# Altium schematic sheet 03 ETHERNET 1 Gbps.SchDoc
size A2; SheetNumber: 4; SheetTotal: 16
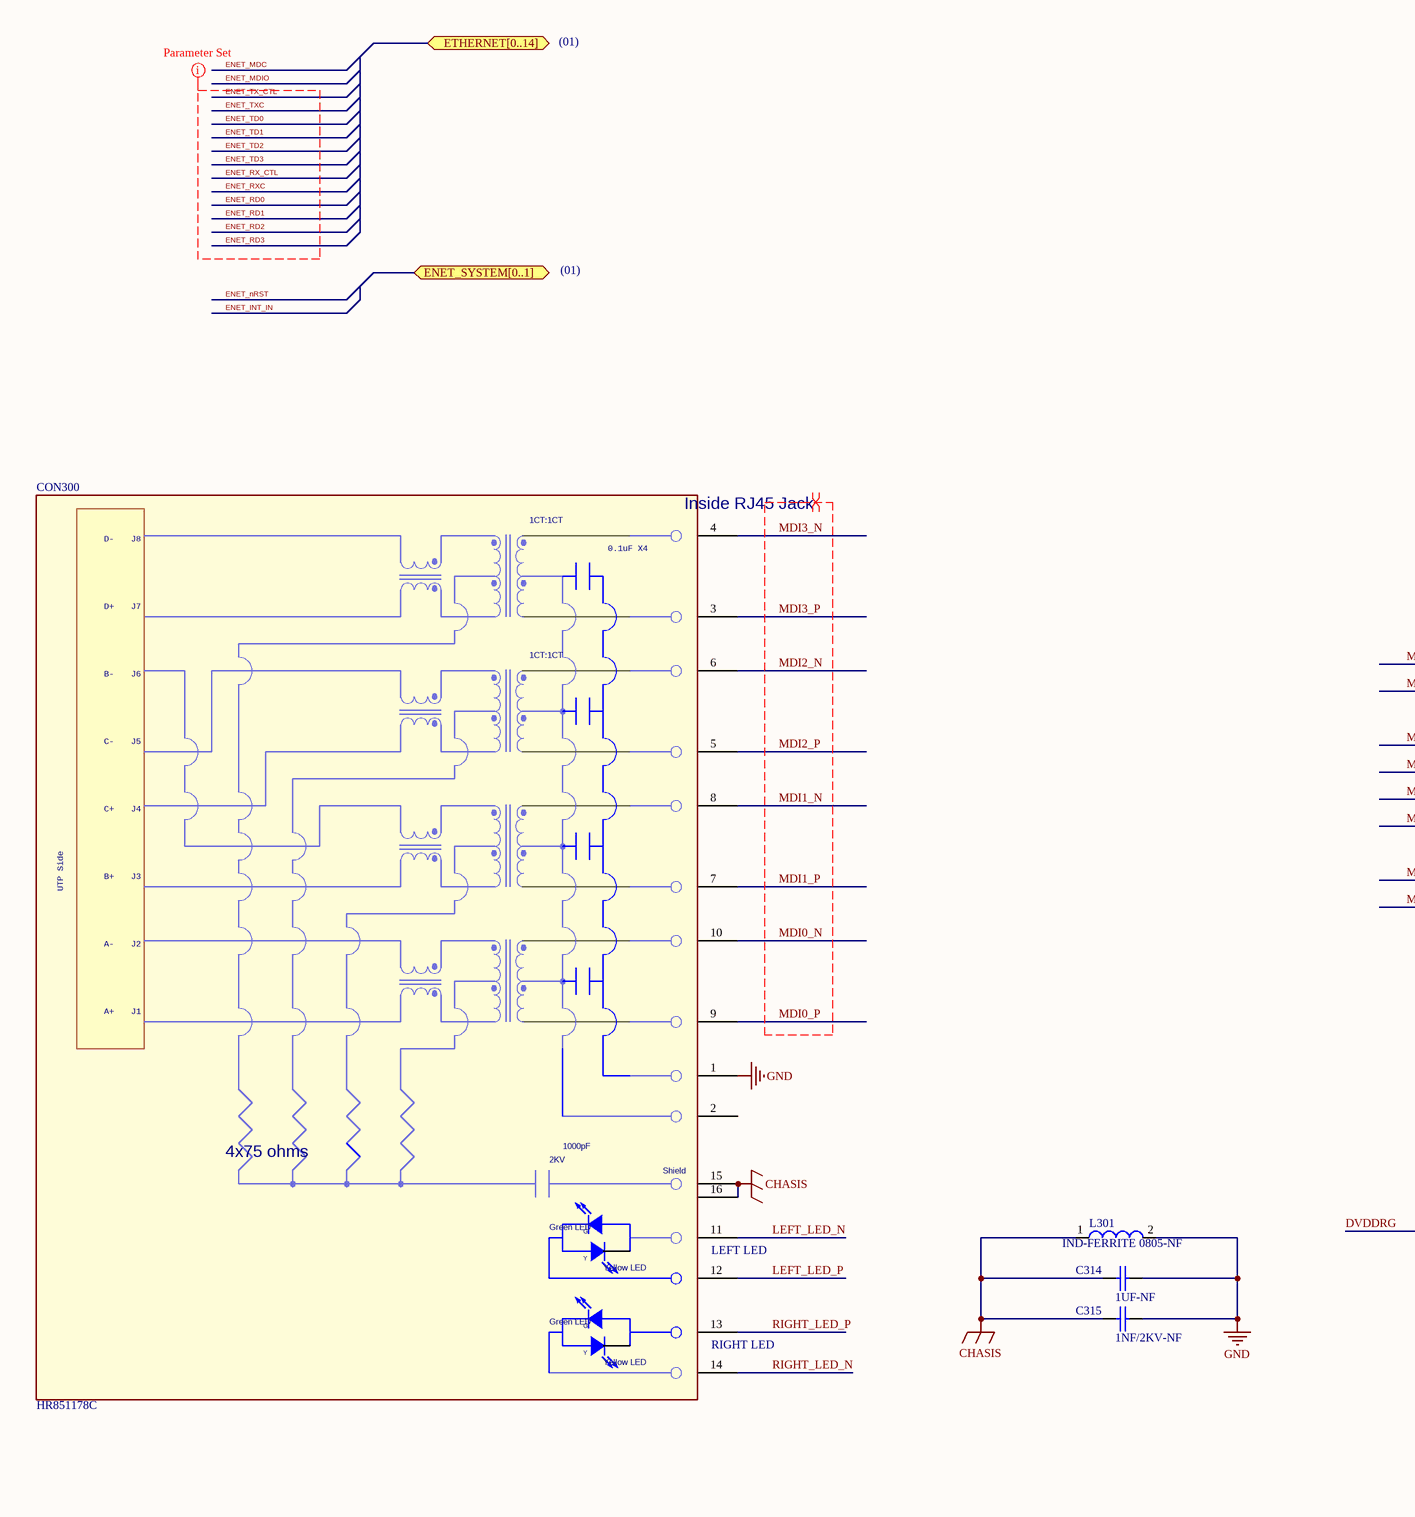
[diagram p0: 03 ETHERNET 1 Gbps.SchDoc, left]
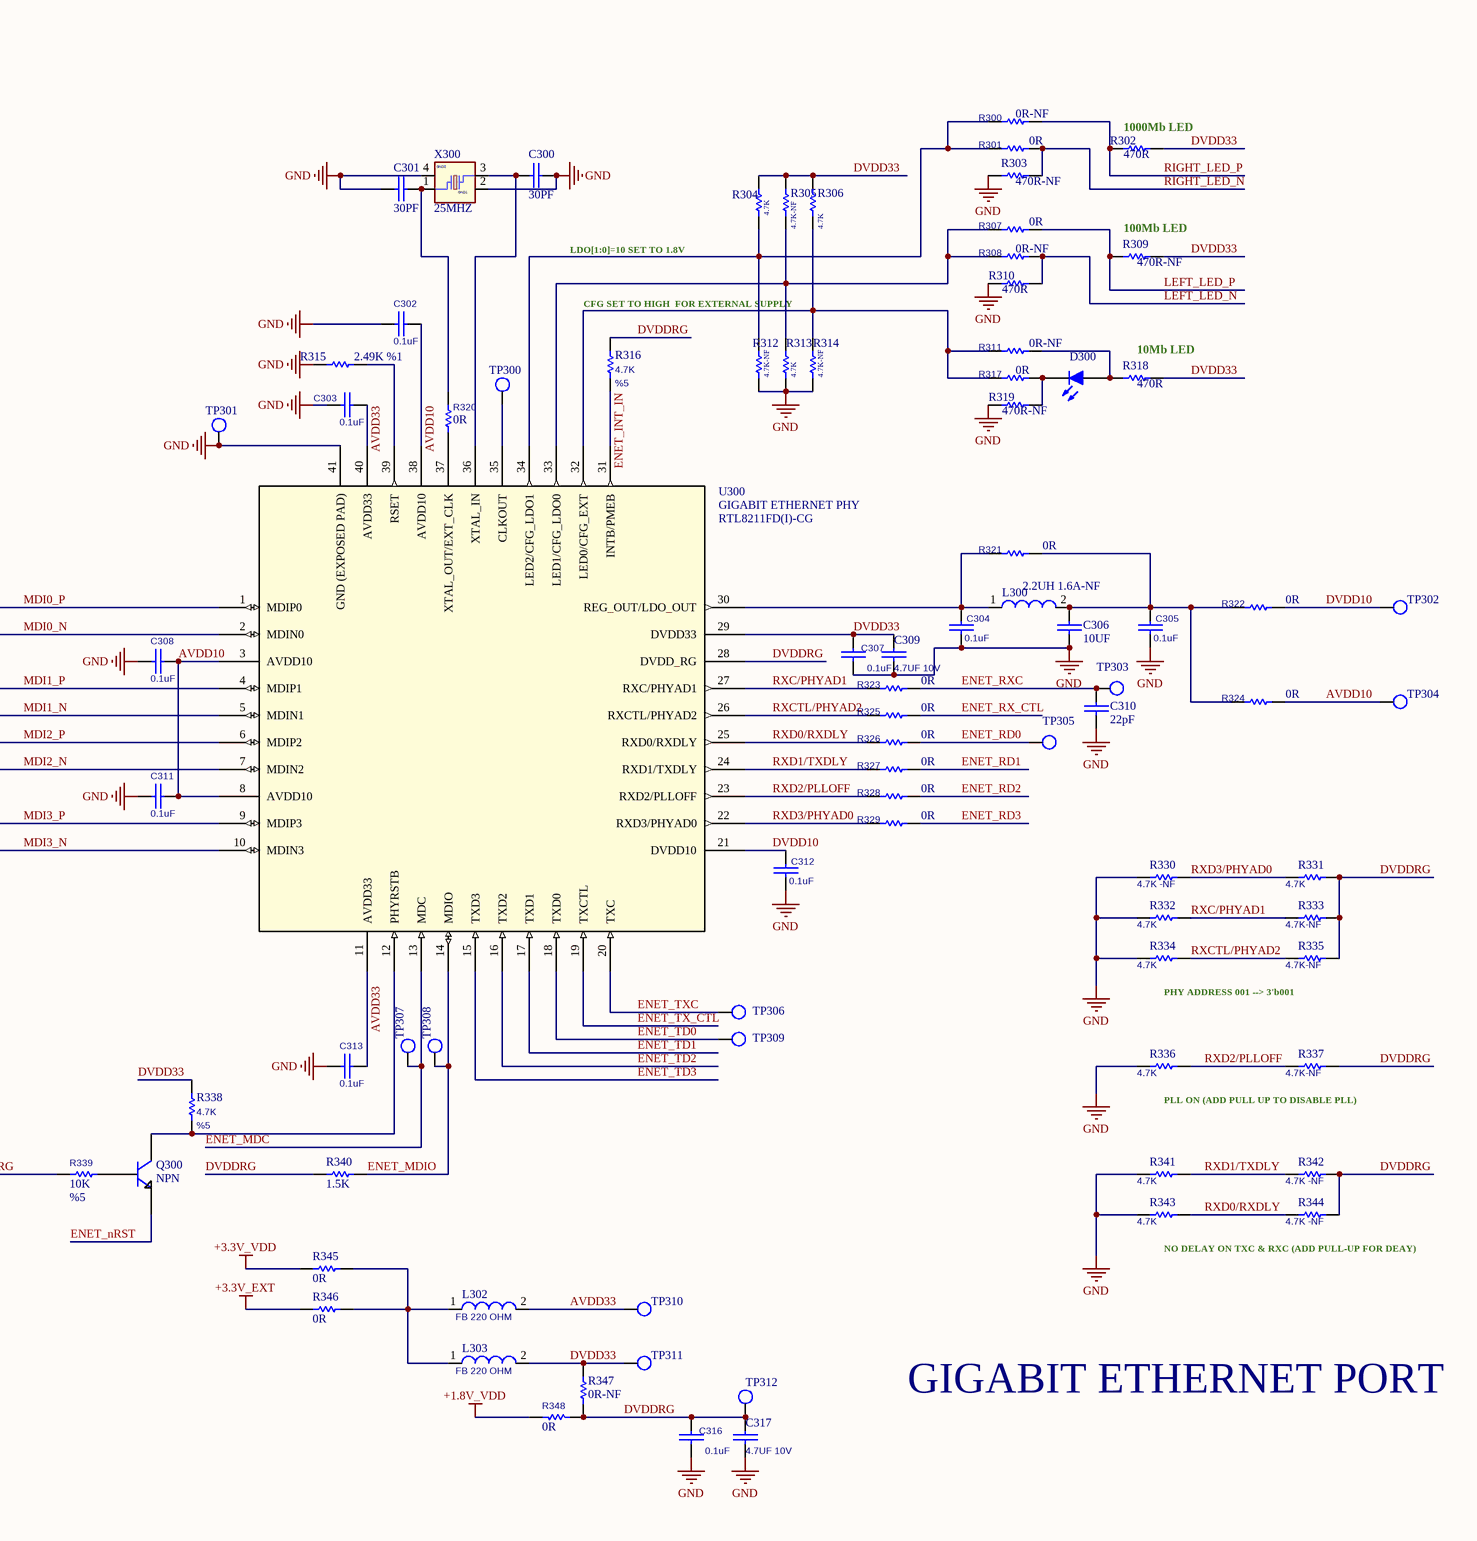
[diagram p1: 03 ETHERNET 1 Gbps.SchDoc, right]

## Parts
C300  30PF  [0402_CC]
C301  30PF  [0402_CC]
C302  0.1uF  [0402_CC]
C303  0.1uF  [0402_CC]
C304  0.1uF  [0402_CC]
C305  0.1uF  [0402_CC]  (no BOM)
C306  10UF  [0805]
C307  0.1uF  [0402_CC]
C308  0.1uF  [0402_CC]
C309  4.7UF 10V  [0402_CC]
C310  22pF  [0402_CC]  (no BOM)
C311  0.1uF  [0402_CC]
C312  0.1uF  [0402_CC]
C313  0.1uF  [0402_CC]
C314  1UF-NF  [0805]  (no BOM)
C315  1NF/2KV-NF  [1206]  (no BOM)
C316  0.1uF  [0402_CC]
C317  4.7UF 10V  [0402_CC]
CON300  HR851178C  [HR851178C]
D300  GREEN  [0603_LED]  (value not drawn)
L300  2.2UH 1.6A-NF  [2016]  (no BOM)
L301  IND-FERRITE 0805-NF  [0805]
L302  FB 220 OHM  [0603_RES]
L303  FB 220 OHM  [0603_RES]
Q300  NPN  [SOT23]
R300  0R-NF  [0402_RES]  (no BOM)
R301  0R  [0402_RES]
R302  470R  [0402_RES]
R303  470R-NF  [0402_RES]  (no BOM)
R304  4.7K  [0402_RES]
R305  4.7K-NF  [0402_RES]  (no BOM)
R306  4.7K  [0402_RES]
R307  0R  [0402_RES]
R308  0R-NF  [0402_RES]  (no BOM)
R309  470R-NF  [0402_RES]  (no BOM)
R310  470R  [0402_RES]
R311  0R-NF  [0402_RES]  (no BOM)
R312  4.7K-NF  [0402_RES]  (no BOM)
R313  4.7K  [0402_RES]
R314  4.7K-NF  [0402_RES]  (no BOM)
R315  2.49K %1  [0603_RES]
R316  4.7K  Tolerance: %5  [0402_RES]
R317  0R  [0402_RES]
R318  470R  [0402_RES]
R319  470R-NF  [0402_RES]  (no BOM)
R320  0R  [0402_RES]
R321  0R  [0402_RES]
R322  0R  [0402_RES]
R323  0R  [0402_RES]
R324  0R  [0402_RES]
R325  0R  [0402_RES]
R326  0R  [0402_RES]
R327  0R  [0402_RES]
R328  0R  [0402_RES]
R329  0R  [0402_RES]
R330  4.7K -NF  [0402_RES]  (no BOM)
R331  4.7K  [0402_RES]
R332  4.7K  [0402_RES]
R333  4.7K-NF  [0402_RES]  (no BOM)
R334  4.7K  [0402_RES]
R335  4.7K-NF  [0402_RES]  (no BOM)
R336  4.7K  [0402_RES]
R337  4.7K-NF  [0402_RES]  (no BOM)
R338  4.7K  Tolerance: %5  [0402_RES]
R339  10K  Tolerance: %5  [0402_RES]
R340  1.5K  [0402_RES]
R341  4.7K  [0402_RES]
R342  4.7K -NF  [0402_RES]  (no BOM)
R343  4.7K  [0402_RES]
R344  4.7K -NF  [0402_RES]  (no BOM)
R345  0R  [0603_RES]
R346  0R  [0603_RES]
R347  0R-NF  [0603_RES]  (no BOM)
R348  0R  [0402_RES]
TP300  TEST POINT 35  [testpoint_15]  (value not drawn)  (no BOM)
TP301  TEST POINT 35  [testpoint_15]  (value not drawn)  (no BOM)
TP302  TEST POINT 35  [testpoint_15]  (value not drawn)  (no BOM)
TP303  TEST POINT 35  [testpoint_15]  (value not drawn)  (no BOM)
TP304  TEST POINT 35  [testpoint_15]  (value not drawn)  (no BOM)
TP305  TEST POINT 35  [testpoint_15]  (value not drawn)  (no BOM)
TP306  TEST POINT 35  [testpoint_15]  (value not drawn)  (no BOM)
TP307  TEST POINT 35  [testpoint_15]  (value not drawn)  (no BOM)
TP308  TEST POINT 35  [testpoint_15]  (value not drawn)  (no BOM)
TP309  TEST POINT 35  [testpoint_15]  (value not drawn)  (no BOM)
TP310  TEST POINT 35  [testpoint_15]  (value not drawn)  (no BOM)
TP311  TEST POINT 35  [testpoint_15]  (value not drawn)  (no BOM)
TP312  TEST POINT 35  [testpoint_15]  (value not drawn)  (no BOM)
U300  GIGABIT ETHERNET PHY  Manufacturer Part Number-1: RTL8211FD(I)-CG  [Quad40]
X300  25MHZ  [XTLOSC4_3P2X2P5MM_SM]

## Ports
ENET_SYSTEM[0..1] (bidir), ETHERNET[0..14] (bidir)

## Nets
+1.8V_VDD: R348.1
+3.3V_EXT: R346.1
+3.3V_VDD: R345.1
CHASIS: C314.1 C315.1 CON300.15(SH1) CON300.16(SH2) L301.1
GND: C300.2 C301.1 C302.1 C303.1 C304.2 C305.2 C306.2 C307.2 C308.1 C309.2 C310.2 C311.1 C312.2 C313.1 C314.2 C315.2 C316.2 C317.2 CON300.1 L301.2 R303.1 R310.1 R312.2 R313.2 R314.2 R315.1 R319.1 R330.2 R332.2 R334.2 R336.2 R341.2 R343.2 TP301.1 U300.41(GND_(EXPOSED_PAD)) X300.2(GND1) X300.4(GND2)
AVDD10: C302.2 C308.2 C311.2 R324.1 TP304.1 U300.3(AVDD10) U300.8(AVDD10) U300.38(AVDD10)
AVDD33: C303.2 C313.2 L302.2 TP310.1 U300.11(AVDD33) U300.40(AVDD33)
DVDD10: C312.1 R322.1 TP302.1 U300.21(DVDD10)
DVDD33: C307.1 C309.1 L303.2 R302.2 R304.1 R305.1 R306.1 R309.2 R318.2 R338.2 R347.2 TP311.1 U300.29(DVDD33)
DVDDRG: C316.1 C317.1 R316.2 R331.1 R333.1 R335.1 R337.1 R339.2 R340.1 R342.1 R344.1 R347.1 R348.2 TP312.1 U300.28(DVDD_RG)
ENET_INT_IN: R316.1 U300.31(INTB/PMEB)
ENET_MDC: TP307.1 U300.13(MDC)
ENET_MDIO: R340.2 TP308.1 U300.14(MDIO)
ENET_nRST: Q300.2(E)
ENET_RD0: R326.1 TP305.1
ENET_RD1: R327.1
ENET_RD2: R328.1
ENET_RD3: R329.1
ENET_RX_CTL: R325.1
ENET_RXC: C310.1 R323.1 TP303.1
ENET_TD0: TP309.1 U300.18(TXD0)
ENET_TD1: U300.17(TXD1)
ENET_TD2: U300.16(TXD2)
ENET_TD3: U300.15(TXD3)
ENET_TX_CTL: U300.19(TXCTL)
ENET_TXC: TP306.1 U300.20(TXC)
LEFT_LED_N: CON300.11 R308.1 R310.2
LEFT_LED_P: CON300.12 R307.1 R309.1
MDI0_N: CON300.10 U300.2(MDIN0)
MDI0_P: CON300.9 U300.1(MDIP0)
MDI1_N: CON300.8 U300.5(MDIN1)
MDI1_P: CON300.7 U300.4(MDIP1)
MDI2_N: CON300.6 U300.7(MDIN2)
MDI2_P: CON300.5 U300.6(MDIP2)
MDI3_N: CON300.4 U300.10(MDIN3)
MDI3_P: CON300.3 U300.9(MDIP3)
RIGHT_LED_N: CON300.14 R301.1 R303.2
RIGHT_LED_P: CON300.13 R300.1 R302.1
RXC/PHYAD1: R323.2 R332.1 R333.2 U300.27(RXC/PHYAD1)
RXCTL/PHYAD2: R325.2 R334.1 R335.2 U300.26(RXCTL/PHYAD2)
RXD0/RXDLY: R326.2 R343.1 R344.2 U300.25(RXD0/RXDLY)
RXD1/TXDLY: R327.2 R341.1 R342.2 U300.24(RXD1/TXDLY)
RXD2/PLLOFF: R328.2 R336.1 R337.2 U300.23(RXD2/PLLOFF)
RXD3/PHYAD0: R329.2 R330.1 R331.2 U300.22(RXD3/PHYAD0)
NetC300_1: C300.1 U300.36(XTAL_IN) X300.3
NetC301_2: C301.2 R320.1 X300.1
NetC304_1: C304.1 L300.1 R321.2 U300.30(REG_OUT/LDO_OUT)
NetC305_1: C305.1 C306.1 L300.2 R321.1 R322.2 R324.2
NetD300_1: D300.1(A) R311.1 R318.1
NetD300_2: D300.2(K) R317.1 R319.2
NetL302_1: L302.1 L303.1 R345.2 R346.2
NetQ300_1: Q300.1(B) R339.1
NetQ300_3: Q300.3(C) R338.1 U300.12(PHYRSTB)
NetR300_2: R300.2 R301.2 R304.2 R312.1 U300.34(LED2/CFG_LDO1)
NetR305_2: R305.2 R307.2 R308.2 R313.1 U300.33(LED1/CFG_LDO0)
NetR306_2: R306.2 R311.2 R314.1 R317.2 U300.32(LED0/CFG_EXT)
NetR315_2: R315.2 U300.39(RSET)
NetR320_2: R320.2 U300.37(XTAL_OUT/EXT_CLK)
NetTP300_1: TP300.1 U300.35(CLKOUT)

Not connected (* = marked no-connect by the designer): CON300 2

## Layout directives
rule Width Constraint [Pref Impedance = 50,00ohms    Min Impedance = 50,00ohms    Max Impedance = 50,00ohms]; net class ETH50: ENET_RD0, ENET_RD1, ENET_RD2, ENET_RD3, ENET_RX_CTL, ENET_RXC, ENET_TD0, ENET_TD1, ENET_TD2, ENET_TD3, ENET_TX_CTL, ENET_TXC
differential pair; differential pair class ETH100; rule Differential Pairs Routing [Pref Gap = 25.683mil    Min Gap  = 5mil    Max Gap  = 25.683milPref Width = 4mil    Min Width  = 3mil    Max Width  = 15mil]; net class ETH100: MDI0_N, MDI0_P, MDI1_N, MDI1_P, MDI2_N, MDI2_P, MDI3_N, MDI3_P

## Notes on the sheet
- (01)
- (near R302) 1000Mb LED
- 01
- (near R309) 100Mb LED
- LDO[1:0]=10 SET TO 1.8V
- CFG SET TO HIGH  FOR EXTERNAL SUPPLY
- (near R318) 10Mb LED
- PHY ADDRESS 001 --> 3'b001
- PLL ON (ADD PULL UP TO DISABLE PLL)
- (near CON300) LEFT LED
- NO DELAY ON TXC & RXC (ADD PULL-UP FOR DEAY)
- (near CON300) RIGHT LED
- GIGABIT ETHERNET PORT
- Sheet Title:
- Inventron
- Size:
- Drawn By:
- Revision:
- Project:
- Checked By:
- A4
- Sheet
- of
- Budotek Teknopark
- Dudullu OSB
- Des 2. Cadde No:8/30
- Umraniye / ISTANBUL
- Electronics and Software
- Date:
- Time:
- ©2020 Inventron Electronics and Software. All rights reserved.
- (in symbol CON-HR851178C) Inside RJ45 Jack; 1CT:1CT; D-; J8; 0.1uF X4; D+; J7; B-; J6; C-; J5; C+; J4; UTP Side; B+; J3; A-; J2; A+; J1; 1000pF; 4x75 ohms; 2KV; Shield; Green LED; G; Y; Yellow LED

## Library data of the parts
C300 C301 = CAP-CC0402JRNPO9BN300: CAP CER 30PF 50V 5% C0G/NPO 0402; Manufacturer-1: Yageo; Class: Capacitor; Manufacturer Part Number-1: CC0402JRNPO9BN300; Footprint: *; Manufacturer-2: *; Manufacturer Part Number-2: *; Inventron Stock No: *; Created By: *; Created Date: *; Checked By: *; ASSY_OPT: *; Dimensions: *; Unit Price: *; Revision Date/Note: *; Price Break: *; Opt. Temp.: *; Features: *
C302-C305 C307 C308 C311-C313 C316 = CAP-CL05B104KO5NNNC: CAP VER 0.1UF 16V X7R 0402; Manufacturer-1: SAMSUNG; Opt. Temp.: -55/+125; Class: Capacitor; Manufacturer Part Number-1: CL05B104KO5NNNC; Footprint: 0402; Manufacturer-2: *; Manufacturer Part Number-2: *; Inventron Stock No: *; Created By: LA; Created Date: 23.11.2018; Checked By: *; ASSY_OPT: *; Dimensions: *; Unit Price: 0,00499; Revision Date/Note: *; Price Break: 10K
C306 = CAP-C0805C106M9RACAUTO: CAP CER 10UF 6.3V X7R 0805; Manufacturer-1: KEMET; Opt. Temp.: -55/+125; Class: Capacitor; Manufacturer Part Number-1: C0805C106M9RACAUTO; Manufacturer-2: *; Manufacturer Part Number-2: *; Inventron Stock No: *; Created By: LA; Created Date: *; Checked By: *; ASSY_OPT: *; Dimensions: *; Unit Price: *; Revision Date/Note: *; Price Break: *; Features: AUTOMOTIVE
C309 C317 = CAP-CL05A475MP5NRNC: CAP CER 4.7UF 10V X5R 0402; Manufacturer-1: Samsung Electro-Mechanics; Class: Capacitor; Manufacturer Part Number-1: CL05A475MP5NRNC; Footprint: 0402; Manufacturer-2: *; Manufacturer Part Number-2: *; Inventron Stock No: *; Created By: EE; Created Date: *; Checked By: *; ASSY_OPT: *; Dimensions: *; Unit Price: 5000; Revision Date/Note: *; Price Break: 0.01576; Opt. Temp.: *; Features: *
C310 = CAP-C0402C220K5GACTU: CAP CER 22PF 50V C0G/NPO 0402; Manufacturer-1: KEMET; Opt. Temp.: -55/+125; Class: Capacitor; Manufacturer Part Number-1: C0402C220K5GACTU; Footprint: 0402; Manufacturer-2: *; Manufacturer Part Number-2: *; Inventron Stock No: *; Created By: LA; Created Date: 23.11.2018; Checked By: *; ASSY_OPT: *; Dimensions: *; Unit Price: 0,00420; Revision Date/Note: *; Price Break: 10K
C314 = CAP-CL21B105KBFNNNG: CAP CER 1UF 50V X7R 0805; Manufacturer-1: SAMSUNG; Class: Capacitor; Manufacturer Part Number-1: CL21B105KBFNNNG; Footprint: *; Manufacturer-2: *; Manufacturer Part Number-2: *; Inventron Stock No: *; Created By: *; Created Date: *; Checked By: *; ASSY_OPT: *; Dimensions: *; Unit Price: *; Revision Date/Note: *; Price Break: *; Opt. Temp.: *; Features: *
C315 = CAP-1206GC102KAT2A: CAP CER 1NF 2KV 10% X7R SMD 1206; Manufacturer-1: KYOCERA; Opt. Temp.: -55/+125; Class: Capacitor; Manufacturer Part Number-1: 1206GC102KAT2A; Manufacturer-2: *; Manufacturer Part Number-2: *; Inventron Stock No: *; Created By: OKS; Created Date: *; Checked By: *; ASSY_OPT: *; Dimensions: *; Unit Price: *; Revision Date/Note: *; Price Break: *; Features: GENERAL PURPOSE
CON300 = CON-HR851178C: GIGABIT ETHERNET CONN; Manufacturer-1: HANRun; Class: Connector; Manufacturer Part Number-1: HR851178C; Footprint: *; Manufacturer-2: *; Manufacturer Part Number-2: *; Inventron Stock No: *; Created By: EE; Created Date: *; Checked By: *; ASSY_OPT: *; Dimensions: *; Unit Price: 2.65; Revision Date/Note: *; Price Break: 1000; Opt. Temp.: *; Features: *
D300 = LED-LTST-C190KRKT: LED SMD 0603 SUPER GREEN; Manufacturer-1: LITEON; Manufacturer Part Number-1: LTST-C190KRKT; Footprint: *; Manufacturer-2: *; Manufacturer Part Number-2: *; Inventron Stock No: *; Created By: *; Created Date: *; Checked By: *; ASSY_OPT: *; Dimensions: *; Unit Price: 0.03343; Revision Date/Note: *; Price Break: 4000; Opt. Temp.: *; Class: Led; Features: *
L300 = IND-CIGT201610LM2R2MNE: FIXED IND 2.2UH 1.6A 154MOHM SMD; Manufacturer-1: Samsung Electro-Mechanics; Class: Inductor; Manufacturer Part Number-1: CIGT201610LM2R2MNE; Manufacturer-2: *; Manufacturer Part Number-2: *; Inventron Stock No: *; Created By: EE; Created Date: *; Checked By: *; ASSY_OPT: *; Dimensions: *; Unit Price: 0.08129; Revision Date/Note: *; Price Break: 1000; Opt. Temp.: *; Features: *
L301 = IND-FERRITE 0805: FERRITE BEAD 0805; Class: Inductor; Manufacturer-2: *; Inventron Stock No: *; Checked By: *; ASSY_OPT: *; Dimensions: *; Revision Date/Note: *
L302 L303 = IND-MPZ1608S221ATA00: Power Line Ferrite Bead 0603 (1608 Metric) 2.2A 50mOhmFERRITE BEAD 220 OHM 0603 1LN; Manufacturer Part Number-1: TDK Corporation; Opt. Temp.: -55 TO 125; Class: Inductor; Footprint: 0603; Manufacturer-1: TDK Corporation; Manufacturer-2: *; Manufacturer Part Number-2: *; Inventron Stock No: *; Created By: E.E; Created Date: 28.10.2020; Checked By: *; ASSY_OPT: *; Dimensions: *; Unit Price: 0.02080; Revision Date/Note: *; Price Break: 4000; Features: *
Q300 = TRANSISTOR-BC846: TRANS PNP 65V 0.1A SOT-23; Manufacturer Part Number-1: BC846B,215; Manufacturer-1: NXP; Footprint: *; Manufacturer-2: *; Manufacturer Part Number-2: *; Inventron Stock No: *; Created By: LA; Created Date: *; Checked By: *; ASSY_OPT: *; Dimensions: *; Unit Price: 0.02306; Revision Date/Note: *; Price Break: 3000; Opt. Temp.: *; Class: TRANSISTOR
R300 R301 R307 R308 R311 R317 R320-R329 R348 = RES-RMCF0402ZT0R00: RES 0 OHM JUMPER 1/16W 0402; Manufacturer-1: STACKPOLE; Opt. Temp.: -55/+155; Class: Resistor; Manufacturer Part Number-1: RMCF0402ZT0R00; Footprint: 0402; Manufacturer-2: *; Manufacturer Part Number-2: *; Inventron Stock No: *; Created By: LA; Created Date: 23.11.2018; Checked By: *; ASSY_OPT: *; Dimensions: *; Unit Price: 0,00127; Revision Date/Note: *; Price Break: 10K
R302 R303 R309 R310 R318 R319 = RES-RC0402FR-07470R: RES SMD 470 OHM 1% 1/16W 0402; Manufacturer Part Number-1: RC0402FR-07470RL; Manufacturer-1: YAGEO; Opt. Temp.: -55/+155; Class: Resistor; Tolerance: %1; Footprint: 0402; Manufacturer-2: *; Manufacturer Part Number-2: *; Inventron Stock No: *; Created By: LA; Created Date: 23.11.2018; Checked By: *; ASSY_OPT: *; Dimensions: *; Unit Price: 0,00211; Revision Date/Note: *; Price Break: 10K
R304-R306 R312-R314 R330-R337 R341-R344 = RES-4.7K: RES 4.7K OHM 5% 1/16W 0402; Manufacturer Part Number-1: RC0402JR-074K7L; Manufacturer-1: Yageo; Opt. Temp.: -55/+155; Class: Resistor; Tolerance: %5; Footprint: 0402; Manufacturer-2: *; Manufacturer Part Number-2: *; Inventron Stock No: *; Created By: LA; Checked By: *; ASSY_OPT: *; Dimensions: *; Revision Date/Note: *
R315 = RES-RMCF0603FT2K49: RES 2.49K OHM 1% 1/10W 0603; Manufacturer-1: Stackpole Electronics Inc; Class: Resistor; Manufacturer Part Number-1: RMCF0603FT2K49; Footprint: *; Manufacturer-2: *; Manufacturer Part Number-2: *; Inventron Stock No: *; Created By: *; Created Date: *; Checked By: *; ASSY_OPT: *; Dimensions: *; Unit Price: *; Revision Date/Note: *; Price Break: *; Opt. Temp.: *; Tolerance: *
R316 R338 = RES-4.7K: RES 4.7K OHM 5% 1/16W 0402; Manufacturer Part Number-1: RC0402JR-074K7L; Manufacturer-1: Yageo; Opt. Temp.: -55/+155; Class: Resistor; Footprint: 0402; Manufacturer-2: *; Manufacturer Part Number-2: *; Inventron Stock No: *; Created By: LA; Checked By: *; ASSY_OPT: *; Dimensions: *; Revision Date/Note: *
R339 = RES-RMCF0402JT10K0: RES 10K OHM 5% 1/16W 0402; Manufacturer-1: STACKPOLE; Opt. Temp.: -55/+155; Class: Resistor; Manufacturer Part Number-1: RMCF0402JT10K0; Footprint: 0402; Manufacturer-2: *; Manufacturer Part Number-2: *; Inventron Stock No: *; Created By: LA; Created Date: 23.11.2018; Checked By: *; ASSY_OPT: *; Dimensions: *; Unit Price: 0,00127; Revision Date/Note: *; Price Break: 10K
R340 = RES-RMCF0402JT1K50: RES SMD 1.5K OHM 5% 1/16W 0402 AUTOMOTIVE; Manufacturer-1: STACKPOLE; Opt. Temp.: -55/+155; Class: Resistor; Tolerance: %5; Manufacturer Part Number-1: RMCF0402JT1K50; Footprint: 0402; Manufacturer-2: *; Manufacturer Part Number-2: *; Inventron Stock No: *; Created By: OKS; Created Date: 10.07.2021; Checked By: *; ASSY_OPT: *; Dimensions: *; Unit Price: 0,00211; Revision Date/Note: *; Price Break: 10K
R345-R347 = RES-RC0603FR-070RL: RES 0R OHM JUMPER 1/10W 0603; Manufacturer-1: YAGEO; Opt. Temp.: -55/+155; Class: Resistor; Manufacturer Part Number-1: RC0603FR-070RL; Footprint: 0603; Manufacturer-2: *; Manufacturer Part Number-2: *; Inventron Stock No: *; Created By: LA; Created Date: *; Checked By: *; ASSY_OPT: *; Dimensions: *; Unit Price: *; Revision Date/Note: *; Price Break: *; Tolerance: *
U300 = IC-RTL8211FD(I)-CG: IC PHY GIGABIT ETHERNET IEEE 802.3AB 40-QFN (5x5); Manufacturer-1: REALTEK; Opt. Temp.: -40°C ~ 85°C (TA); Class: ICs; Footprint: 40-QFN; Manufacturer-2: *; Manufacturer Part Number-2: *; Inventron Stock No: *; Created By: OKS; Created Date: 02.02.2022; Checked By: *; ASSY_OPT: *; Dimensions: *; Unit Price: *; Revision Date/Note: *; Price Break: *
X300 = XTAL-TSX-3225 25.0000MF18X-G: CRYSTAL 25.0000MHZ 20PF 10PPM SMD; Manufacturer-1: EPSON; Opt. Temp.: +40/+85; Manufacturer Part Number-1: TSX-3225 25.0000MF18X-G; Footprint: 4-SMD; Manufacturer-2: *; Manufacturer Part Number-2: *; Inventron Stock No: *; Created By: OKS; Created Date: 11.02.2022; Checked By: *; ASSY_OPT: *; Dimensions: *; Unit Price: 0,24; Revision Date/Note: *; Price Break: 1K; Class: Crystal